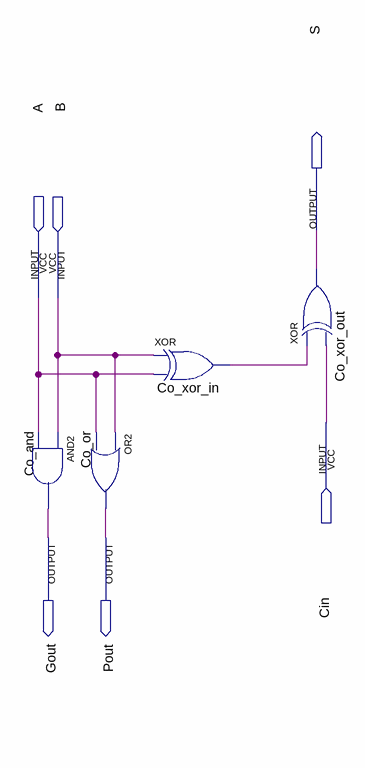
[diagram p0: schematic sheet]
// Quartus schematic blockX.bdf as structural Verilog: 4 symbols, 6 pins
module blockX (
  input  A,
  input  B,
  input  Cin,
  output S,
  output Gout,
  output Pout
);

  wire Co_xor_in_out;

  and Co_and (Gout, B, A);
  or Co_or (Pout, B, A);
  xor Co_xor_in (Co_xor_in_out, B, A);
  xor Co_xor_out (S, Co_xor_in_out, Cin);
endmodule
